# EAGLE design working (EAGLE 5.10)
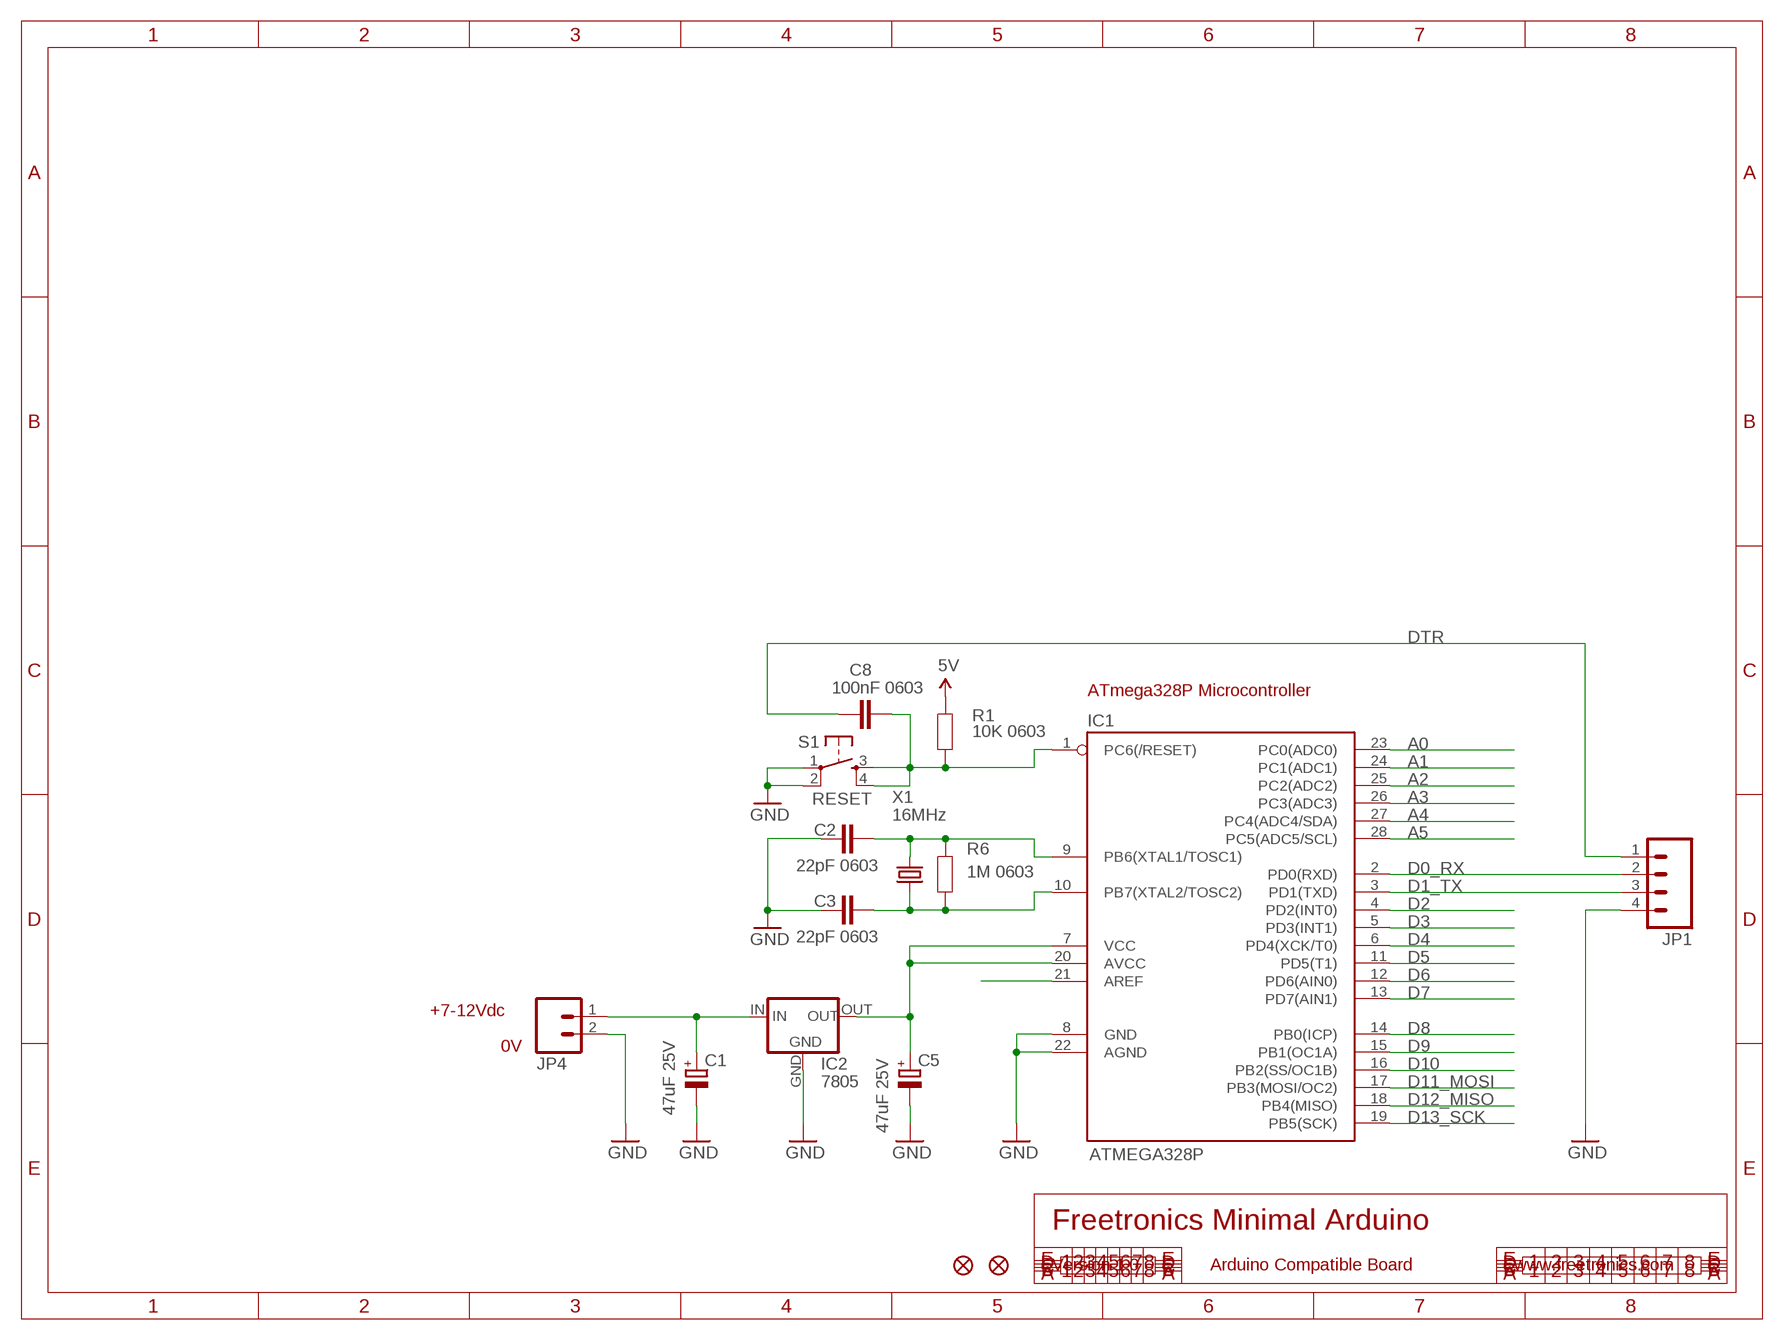
[diagram p0: schematic, sheet 1]

## Parts
C1  47uF 25V  CPOL-EUD  [PANASONIC_D]
C2  22pF 0603  CAP0603  [0603]
C3  22pF 0603  CAP0603  [0603]
C5  47uF 25V  CPOL-EUD  [PANASONIC_D]
C8  100nF 0603  CAP0603  [0603]
IC1  ATMEGA328P  AVR-MEGA8-P  [DIL28-3]
IC2  7805  V_REG_78XXSIDE  [78XXL]
JP1  M04PTH  [1X04]
JP4  M02PTH  [1X02]
R1  10K 0603  RESISTOR0603  [0603]
R6  1M 0603  RESISTOR0603  [0603]
S1  RESET  TAC_SWITCHSMD  [TACTILE_SWITCH_SMD]
U$5  FIDUCIAL1X2.5  [FIDUCIAL-1X2.5]
U$14  FIDUCIAL1X2.5  [FIDUCIAL-1X2.5]
X1  16MHz  CRYSTALHC49UV  [HC49U-V]

## Nets
5V: R1.2
A0: IC1.23(PC0(ADC0))
A1: IC1.24(PC1(ADC1))
A2: IC1.25(PC2(ADC2))
A3: IC1.26(PC3(ADC3))
A4: IC1.27(PC4(ADC4/SDA))
A5: IC1.28(PC5(ADC5/SCL))
AREF: IC1.21(AREF)
D0_RX: IC1.2(PD0(RXD)) JP1.2
D1_TX: IC1.3(PD1(TXD)) JP1.3
D2: IC1.4(PD2(INT0))
D3: IC1.5(PD3(INT1))
D4: IC1.6(PD4(XCK/T0))
D5: IC1.11(PD5(T1))
D6: IC1.12(PD6(AIN0))
D7: IC1.13(PD7(AIN1))
D8: IC1.14(PB0(ICP))
D9: IC1.15(PB1(OC1A))
D10: IC1.16(PB2(SS/OC1B))
D11_MOSI: IC1.17(PB3(MOSI/OC2))
D12_MISO: IC1.18(PB4(MISO))
D13_SCK: IC1.19(PB5(SCK))
DTR: C8.1 JP1.1
GND: C1.- C2.1 C3.1 C5.- IC1.8(GND) IC1.22(AGND) IC2.GND JP1.4 JP4.2 S1.1 S1.2
N$1: C5.+ IC1.7(VCC) IC1.20(AVCC) IC2.OUT
N$5: C2.2 IC1.9(PB6(XTAL1/TOSC1)) R6.2 X1.2
N$7: C3.2 IC1.10(PB7(XTAL2/TOSC2)) R6.1 X1.1
RESET: C8.2 IC1.1(PC6(/RESET)) R1.1 S1.3 S1.4
VIN: C1.+ IC2.IN JP4.1

## Notes on the sheet
- ATmega328P Microcontroller
- +7-12Vdc
- 0V
- Freetronics Minimal Arduino
- Version 1.0 | Arduino Compatible Board | www.freetronics.com

## Library data of the parts
C1 C5 = rcl:CPOL-EU: POLARIZED CAPACITOR, European symbol
C2 C3 C8 = freetronics:CAP: Capacitor Standard 0603 ceramic capacitor, and 0.1" leaded capacitor.
IC1 = freetronics:AVR-MEGA8-P: MICROCONTROLLER 8 Kbytes FLASH 1 kbytes SRAM 512 bytes EEPROM USART 4-channel 10 bit ADC 2-channel 8 bit ADC
IC2 = freetronics-master-v1.1:V_REG_78XX
JP1 = freetronics-master-v1.1:M04: Header 4 Standard 4-pin 0.1" header. Use with straight break away headers (SKU : PRT-00116), right angle break away headers (PRT-00553), swiss pins (PRT-00743), machine pins (PRT-00117), and female headers (PRT-00115). Molex polarized connector foot print use with SKU : PRT-08231 with associated crimp pins and housings.
JP4 = freetronics-master-v1.1:M02: Header 2 Standard 2-pin 0.1" header. Use with straight break away headers (SKU : PRT-00116), right angle break away headers (PRT-00553), swiss pins (PRT-00743), machine pins (PRT-00117), and female headers (PRT-00115). Molex polarized connector foot print use with SKU : PRT-08233 with associated crimp pins and housings.
R1 R6 = freetronics:RESISTOR: Resistor Basic schematic elements and footprints for 0603, 1206, and PTH 1/10th watt (small) resistors.
S1 = freetronics:TAC_SWITCH: Momentary Switch Button commonly used for reset or general input. Spark Fun Electronics SKU : COM-00097
U$5 U$14 = freetronics:FIDUCIAL: Fiducial Alignment Points Various fiducial points for machine vision alignment.
X1 = freetronics-master-v1:CRYSTAL: Crystals Various standard crystals. Proven footprints. Spark Fun Electronics SKU : COM-00534

## Board
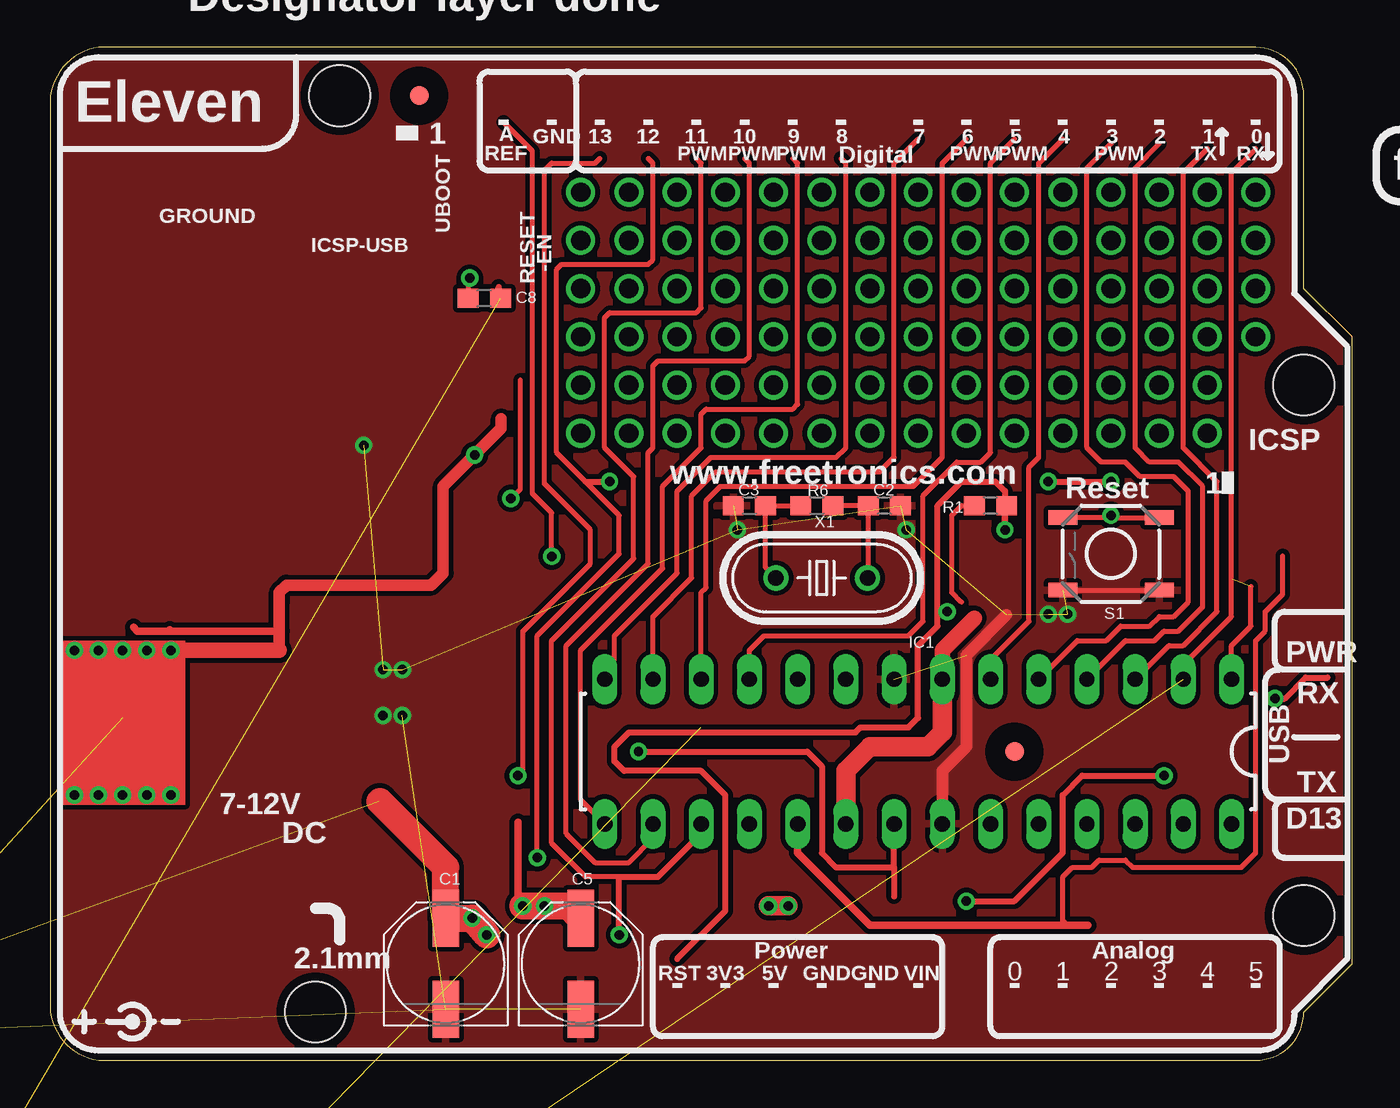
[diagram p1: board, top side]
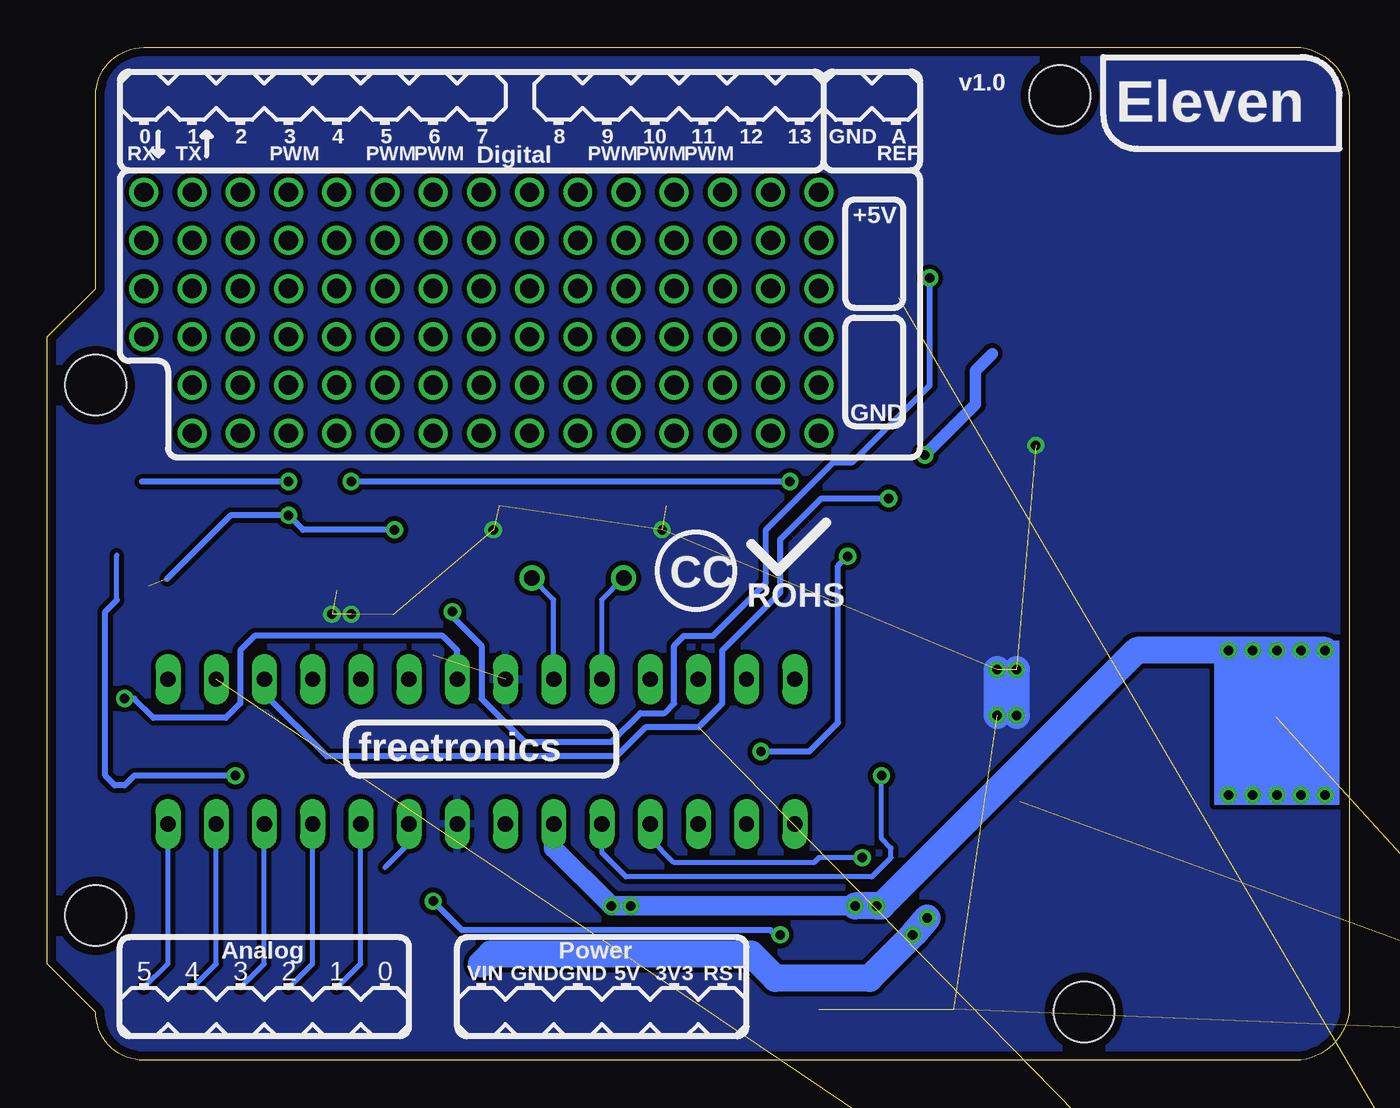
[diagram p2: board, bottom side, seen from below]

Size 68.58 x 53.34 mm. Coordinates in mm from the lower left corner, seen from the top.
Outline: 0,2.54 arc74 2.54,0 63.5,0 arc90 66.04,2.54 68.58,5.08 68.58,38.1 66.04,40.64 66.04,50.8 arc90 63.5,53.34 2.54,53.34 arc74 0,50.8 0,2.54
Copper layers (1*16): Top 0.035mm / dielectric 1.5mm / Bottom 0.035mm
Design rules "default *": minimum track width 10mil, minimum drill 18mil, track to track 10mil, track to pad 10mil, pad to pad 10mil, via to via 10mil, smd to smd 8mil, copper to edge 18mil, drill to drill 8mil, minimum pad ring 10mil, minimum via ring 8mil, stop-mask expansion 4mil, vias tented up to drill 25mil, thermal gap 10mil
Holes 3.2 mm at 66.04,35.56 66.04,7.62 15.24,50.8 13.97,2.54
tRestrict: area 18.4,49.8 to 20.4,51.8; area 49.8,15.2 to 51.8,17.3

### Footprints (pad centres in the part's own frame; a part is rotated, then mirrored left to right if it is on the bottom)
PANASONIC_D = smd 3 x 1.4: + 2.4,0; - -2.4,0
0603 = smd 1.1 x 1: 1 -0.85,0; 2 0.85,0
DIL28-3 = drill 0.813 long: 1 -16.51,-3.81; 2 -13.97,-3.81; 3 -11.43,-3.81; 4 -8.89,-3.81; 5 -6.35,-3.81; 6 -3.81,-3.81; 7 -1.27,-3.81; 8 1.27,-3.81; 9 3.81,-3.81; 10 6.35,-3.81; 11 8.89,-3.81; 12 11.43,-3.81; 13 13.97,-3.81; 14 16.51,-3.81; 15 16.51,3.81; 16 13.97,3.81; 17 11.43,3.81; 18 8.89,3.81; 19 6.35,3.81; 20 3.81,3.81; 21 1.27,3.81; 22 -1.27,3.81; 23 -3.81,3.81; 24 -6.35,3.81; 25 -8.89,3.81; 26 -11.43,3.81; 27 -13.97,3.81; 28 -16.51,3.81
78XXL = drill 1.016 long: GND 0,-3.81; IN -2.54,-3.81; OUT 2.54,-3.81 | hole 3.302: 0,11.176
1X04 = drill 1.016 square: 1 0,0 | drill 1.016 round: 2 2.54,0; 3 5.08,0; 4 7.62,0
1X02 = drill 1.016 round: 1 0,0; 2 2.54,0
TACTILE_SWITCH_SMD = smd 1.524 x 0.762: 1 -2.54,1.905; 2 2.54,1.905; 3 -2.54,-1.905; 4 2.54,-1.905
FIDUCIAL-1X2.5 = smd 1 x 1: 1 0,0
HC49U-V = drill 0.813 round: 1 -2.413,0; 2 2.413,0

### Placement (x,y rotation side)
C1  20.83,5.08 90 top
C2  43.94,29.21 180 top
C3  36.83,29.21 0 top
C5  27.94,5.08 90 top
C8  22.86,40.13 180 top
IC1  45.72,16.26 180 top
IC2  -13.97,5.08 0 top  (outside the outline)
JP1  -17.78,-30.48 0 top  (outside the outline)
JP4  -17.78,-24.13 0 top  (outside the outline)
R1  49.53,29.21 180 top
R6  40.39,29.21 0 top
S1  55.88,26.67 180 top
U$5  19.43,50.8 0 top
U$14  50.8,16.26 0 top
X1  40.64,25.4 0 top

### Tracks (layer width: path | path; a pad name or v marks a point on that pad's centre or on a via)
5V
  Top 0.254: R1.2 48.01,29.21 47.5,28.7 47.5,24.64 48.01,24.13
A0
  Bottom 0.254: 50.8,10.16 49.53,11.43 IC1.23
A1
  Bottom 0.254: 53.34,3.81 52.07,5.08 IC1.24
A2
  Bottom 0.254: 55.88,3.81 54.61,5.08 IC1.25
A3
  Bottom 0.254: 58.42,3.81 57.15,5.08 IC1.26
A4
  Bottom 0.254: 60.96,3.81 59.69,5.08 IC1.27
A5
  Bottom 0.254: 63.5,3.81 62.23,5.08 IC1.28
AREF  (via drill 0.5)
  Top 0.254: 23.88,49.4 25.4,47.88 25.4,29.84 26.42,28.83 v26.42,26.54
  Top 0.305: 44.45,10.16 44.45,8.64 | 44.45,10.16 IC1.21 | 44.45,10.16 41.4,10.16 40.64,10.92 40.64,15.49 39.88,16.26 v30.99,16.26
  Bottom 0.305: v30.99,16.26 28.45,16.26 26.92,17.78 26.92,26.04 v26.42,26.54
D0_RX  (1 unrouted)
  Top 0.254: IC1.2 59.69,20.83 62.23,23.37 62.23,46.74 63.5,48.01
D1_TX  (via drill 0.5)  (1 unrouted)
  Top 0.254: IC1.3 58.93,21.84 59.69,21.84 61.47,23.62 61.47,30.48 59.69,32.26 59.69,46.74 60.96,48.01 | v24.26,29.59 24.77,30.1 24.77,35.81
  Bottom 0.305: v24.26,29.59 27.81,29.59 29.97,27.43 29.97,24.64 33.02,21.59 33.02,18.8 34.29,17.53 37.08,17.53 38.61,16 53.85,16 57.15,19.3 IC1.3
D2
  Top 0.254: IC1.4 56.64,22.1 58.17,22.1 58.67,22.61 59.44,22.61 60.71,23.88 60.71,30.23 59.44,31.5 57.91,31.5 57.15,32.26 57.15,46.99 58.42,48.26
D3
  Top 0.254: IC1.5 54.1,22.1 55.63,22.1 56.39,22.86 57.91,22.86 58.42,23.37 59.18,23.37 59.94,24.13 59.94,29.97 59.18,30.73 57.4,30.73 56.64,31.5 55.37,31.5 54.61,32.26 54.61,46.99 55.88,48.26
D4
  Top 0.254: IC1.6 49.53,21.08 51.56,23.11 51.56,31.24 52.07,31.75 52.07,47.24 53.34,48.51
D5
  Top 0.254: 50.8,48.51 49.53,47.24 49.53,32 49.02,31.5 47.75,31.5 45.97,29.72 45.97,23.11 45.21,22.35 37.59,22.35 36.83,21.59 IC1.11
D6
  Top 0.254: 48.26,48.51 46.99,47.24 46.99,31.75 45.47,30.23 35.31,30.23 34.54,29.46 34.54,24.89 34.29,24.64 IC1.12
D7
  Top 0.254: 45.72,48.51 44.45,47.24 44.45,31.75 43.69,30.99 35.05,30.99 33.78,29.72 33.78,25.4 31.75,23.37 IC1.13
D8
  Top 0.254: 41.66,47.5 41.91,47.24 41.91,32.26 41.4,31.75 34.8,31.75 33.02,29.97 33.02,25.65 29.72,22.35 29.72,21.08 29.21,20.57 IC1.14
D9
  Top 0.254: 39.12,47.5 39.37,47.24 39.37,34.54 39.12,34.29 34.54,34.29 34.29,34.04 34.29,32.26 32.26,30.23 32.26,25.91 27.94,21.59 27.94,13.72 IC1.15
D10
  Top 0.254: 36.58,47.5 36.83,47.24 36.83,37.08 36.58,36.83 32,36.83 31.75,36.58 31.75,32.26 31.5,32 31.5,26.16 27.18,21.84 27.18,11.94 28.7,10.41 30.48,10.41 31.75,11.68 IC1.16
D11_MOSI  (via drill 0.5)
  Top 0.254: 34.04,47.5 34.29,47.24 34.29,39.62 34.04,39.37 29.46,39.37 29.21,39.12 29.21,32.26 30.73,30.73 30.73,26.42 26.42,22.1 26.42,11.43 28.19,9.65 30.23,9.65
  Top 0.305: IC1.17 34.29,11.94 32,9.65 30.23,9.65 29.97,9.65 v29.97,6.6 | v58.67,14.99 54.36,14.99 53.34,13.97 53.34,10.92 50.8,8.38 v48.26,8.38
  Bottom 0.254: 64.92,24.23 64.92,26.61
  Bottom 0.305: 64.92,24.23 65.53,23.62 65.53,14.99 65.02,14.48 64.52,14.48 64.01,14.99 v58.67,14.99 | v48.26,8.38 46.74,6.86 30.48,6.86 30.23,6.6 v29.97,6.6
D12_MISO  (via drill 0.5)
  Top 0.254: 31.5,47.5 31.75,47.24 31.75,42.16 31.5,41.91 26.92,41.91 26.67,41.66 26.67,32 28.19,30.48 29.97,28.7 29.97,26.67 25.65,22.35 v25.65,10.67
  Top 0.305: v52.58,30.48 v55.88,30.48 | 28.19,30.48 v29.46,30.48
  Bottom 0.254: v25.65,10.67 27.94,10.67 28.19,10.41 35.56,10.41 36.83,11.68 IC1.18
  Bottom 0.305: v55.88,30.48 63.59,30.48 | v29.46,30.48 v52.58,30.48
D13_SCK  (via drill 0.5)
  Top 0.254: 28.96,47.5 28.7,47.24 26.42,47.24 26.04,46.86 26.04,30.35 28.45,27.94 28.45,26.16 24.89,22.61 24.89,15.24 v24.64,14.99 | 64.92,26.57 64.92,24.54 64.01,23.62 64.01,22.61 63.5,22.1 63.5,10.92 62.74,10.16 57.02,10.16 56.64,10.54 55.24,10.54 54.86,10.16 53.85,10.16 53.34,9.65 53.34,7.37 53.59,7.11
  Top 0.406: IC1.19 39.37,10.92 43.18,7.11 53.59,7.11 54.66,7.11
  Bottom 0.254: v24.64,14.99 24.64,11.68 24.13,11.18 24.13,10.67 25.15,9.65 38.1,9.65 39.37,10.92 IC1.19
DTR  (1 unrouted)
  Top 0.305: C8.1 23.62,40.73
GND  (via drill 0.5)  (16 unrouted)
  Top 0.254: S1.2 S1.1
  Top 0.61: 50.38,23.46 48.26,21.34 48.26,16.51 46.99,15.24 IC1.22
  Bottom 1.422: v18.54,18.16 v18.54,20.57 | v17.53,18.16 v17.53,20.57
  other vias: 36.2,27.94 16.51,32.38 52.58,23.5 53.59,23.5 45.09,27.94
  pour Bottom: 0,50.8 arc-74 2.54,53.34 63.5,53.34 arc-74 66.04,50.8 66.04,40.64 68.58,38.1 68.58,5.08 66.04,2.54 arc-74 63.5,0 2.54,0 arc-74 0,2.54
  pour Top: 0,50.8 arc-74 2.54,53.34 63.5,53.34 arc-74 66.04,50.8 66.04,40.64 68.58,38.1 68.58,5.08 66.04,2.54 arc-74 63.5,0 2.54,0 arc-74 0,2.54
N$1  (via drill 0.5)  (1 unrouted)
  Top 0.254: 12.06,24.13 11.98,24.05
  Top 0.305: 67.3,20.15 66.12,20.15 65.02,19.05 v64.52,19.05
  Top 0.406: v24.89,8.13 24.64,8.38 24.64,12.53 | 4.38,22.79 4.57,22.61 6.22,22.61 | 12.06,22.61 6.22,22.61 | 6.22,22.61 6.28,22.67
  Top 0.61: 23.75,33.78 23.75,33.27 v22.35,31.88 20.7,30.23 20.7,25.65 20.07,25.02 12.45,25.02 12.06,24.64 12.06,24.13 12.06,22.61 12.06,21.59
  Top 0.813: v5.08,21.59 v6.35,21.59 12.06,21.59 | IC1.7 46.99,21.59 48.68,23.28
  Top 1.016: 3.85,18.07 5.08,19.3 v5.08,21.59 | v37.85,8.13 38.1,8.13 v38.86,8.13 | IC1.20 41.91,15.24 43.18,16.51 46.23,16.51 46.99,17.27 IC1.7
  Top 1.422: C5.+ 27.29,8.13 v24.89,8.13
  Bottom 0.305: v64.52,19.05 64.01,19.05 62.99,18.03 59.18,18.03 58.42,18.8 58.42,21.59 57.66,22.35 47.75,22.35 46.99,21.59 IC1.7
  Bottom 0.61: 18.8,37.21 19.68,36.32 19.68,34.54 v22.35,31.88
  Bottom 1.016: IC1.20 41.91,11.18 v38.86,8.13 v37.85,8.13 v26.04,8.13
  Bottom 1.422: v26.04,8.13 v24.89,8.13 24.64,8.13 11.18,21.59 v6.35,21.59 1.27,21.59
N$5
  Top 0.254: R6.2 C2.2 43.09,25.44 X1.2
  Bottom 0.254: X1.2 41.91,24.26 IC1.9
N$7
  Top 0.254: X1.1 37.68,25.95 C3.2 R6.1
  Bottom 0.254: X1.1 39.37,24.26 IC1.10
N$15  (via drill 1.02)
  other vias: 33.02,40.64
N$18  (via drill 1.02)
  other vias: 33.02,43.18
N$19  (via drill 1.02)
  other vias: 33.02,45.72
N$20  (via drill 1.02)
  other vias: 30.48,40.64
N$21  (via drill 1.02)
  other vias: 30.48,43.18
N$22  (via drill 1.02)
  other vias: 30.48,45.72
N$23  (via drill 1.02)
  other vias: 27.94,40.64
N$24  (via drill 1.02)
  other vias: 27.94,43.18
N$25  (via drill 1.02)
  other vias: 27.94,45.72
N$26  (via drill 1.02)
  other vias: 40.64,40.64
N$27  (via drill 1.02)
  other vias: 40.64,43.18
N$28  (via drill 1.02)
  other vias: 40.64,45.72
N$29  (via drill 1.02)
  other vias: 38.1,40.64
N$30  (via drill 1.02)
  other vias: 38.1,43.18
N$31  (via drill 1.02)
  other vias: 38.1,45.72
N$32  (via drill 1.02)
  other vias: 35.56,40.64
N$33  (via drill 1.02)
  other vias: 35.56,43.18
N$34  (via drill 1.02)
  other vias: 35.56,45.72
N$35  (via drill 1.02)
  other vias: 48.26,40.64
N$36  (via drill 1.02)
  other vias: 48.26,43.18
N$37  (via drill 1.02)
  other vias: 48.26,45.72
N$38  (via drill 1.02)
  other vias: 45.72,40.64
N$39  (via drill 1.02)
  other vias: 45.72,43.18
N$40  (via drill 1.02)
  other vias: 45.72,45.72
N$41  (via drill 1.02)
  other vias: 43.18,40.64
N$42  (via drill 1.02)
  other vias: 43.18,43.18
N$43  (via drill 1.02)
  other vias: 43.18,45.72
N$44  (via drill 1.02)
  other vias: 55.88,40.64
N$45  (via drill 1.02)
  other vias: 55.88,43.18
N$46  (via drill 1.02)
  other vias: 55.88,45.72
N$47  (via drill 1.02)
  other vias: 53.34,40.64
N$48  (via drill 1.02)
  other vias: 53.34,43.18
N$49  (via drill 1.02)
  other vias: 53.34,45.72
N$50  (via drill 1.02)
  other vias: 50.8,40.64
N$51  (via drill 1.02)
  other vias: 50.8,43.18
N$52  (via drill 1.02)
  other vias: 50.8,45.72
N$53  (via drill 1.02)
  other vias: 63.5,40.64
N$54  (via drill 1.02)
  other vias: 63.5,43.18
N$55  (via drill 1.02)
  other vias: 63.5,45.72
N$56  (via drill 1.02)
  other vias: 60.96,40.64
N$57  (via drill 1.02)
  other vias: 60.96,43.18
N$58  (via drill 1.02)
  other vias: 60.96,45.72
N$59  (via drill 1.02)
  other vias: 58.42,40.64
N$60  (via drill 1.02)
  other vias: 58.42,43.18
N$61  (via drill 1.02)
  other vias: 58.42,45.72
N$62  (via drill 1.02)
  other vias: 33.02,33.02
N$63  (via drill 1.02)
  other vias: 33.02,35.56
N$64  (via drill 1.02)
  other vias: 33.02,38.1
N$65  (via drill 1.02)
  other vias: 30.48,33.02
N$66  (via drill 1.02)
  other vias: 30.48,35.56
N$67  (via drill 1.02)
  other vias: 30.48,38.1
N$68  (via drill 1.02)
  other vias: 27.94,33.02
N$69  (via drill 1.02)
  other vias: 27.94,35.56
N$70  (via drill 1.02)
  other vias: 27.94,38.1
N$71  (via drill 1.02)
  other vias: 40.64,33.02
N$72  (via drill 1.02)
  other vias: 40.64,35.56
N$73  (via drill 1.02)
  other vias: 40.64,38.1
N$74  (via drill 1.02)
  other vias: 38.1,33.02
N$75  (via drill 1.02)
  other vias: 38.1,35.56
N$76  (via drill 1.02)
  other vias: 38.1,38.1
N$77  (via drill 1.02)
  other vias: 35.56,33.02
N$78  (via drill 1.02)
  other vias: 35.56,35.56
N$79  (via drill 1.02)
  other vias: 35.56,38.1
N$80  (via drill 1.02)
  other vias: 48.26,33.02
N$81  (via drill 1.02)
  other vias: 48.26,35.56
N$82  (via drill 1.02)
  other vias: 48.26,38.1
N$83  (via drill 1.02)
  other vias: 45.72,33.02
N$84  (via drill 1.02)
  other vias: 45.72,35.56
N$85  (via drill 1.02)
  other vias: 45.72,38.1
N$86  (via drill 1.02)
  other vias: 43.18,33.02
N$87  (via drill 1.02)
  other vias: 43.18,35.56
N$88  (via drill 1.02)
  other vias: 43.18,38.1
N$89  (via drill 1.02)
  other vias: 55.88,33.02
N$90  (via drill 1.02)
  other vias: 55.88,35.56
N$91  (via drill 1.02)
  other vias: 55.88,38.1
N$92  (via drill 1.02)
  other vias: 53.34,33.02
N$93  (via drill 1.02)
  other vias: 53.34,35.56
N$94  (via drill 1.02)
  other vias: 53.34,38.1
N$95  (via drill 1.02)
  other vias: 50.8,33.02
N$96  (via drill 1.02)
  other vias: 50.8,35.56
N$97  (via drill 1.02)
  other vias: 50.8,38.1
N$98  (via drill 0.5)
  other vias: 6.35,13.97
N$99  (via drill 0.5)
  other vias: 5.08,13.97
N$100  (via drill 1.02)
  other vias: 63.5,38.1
N$101  (via drill 1.02)
  other vias: 60.96,33.02
N$102  (via drill 1.02)
  other vias: 60.96,35.56
N$103  (via drill 1.02)
  other vias: 60.96,38.1
N$104  (via drill 1.02)
  other vias: 58.42,33.02
N$105  (via drill 1.02)
  other vias: 58.42,35.56
N$106  (via drill 1.02)
  other vias: 58.42,38.1
N$107  (via drill 0.5)
  other vias: 3.81,13.97
N$108  (via drill 0.5)
  other vias: 2.54,13.97
N$109  (via drill 0.5)
  other vias: 3.81,21.59
N$110  (via drill 0.5)
  other vias: 2.54,21.59
N$111  (via drill 0.5)
  other vias: 1.27,21.59
N$112  (via drill 0.5)
  other vias: 1.27,13.97
RESET  (via drill 0.5)  (1 unrouted)
  Top 0.254: IC1.1 62.23,21.84 63.25,22.86 63.25,24.96 | 55.88,28.57 S1.4 | 55.88,28.57 S1.3 | v55.88,28.7 55.88,28.57 | 50.29,29.3 R1.1 | C8.2 22.01,41.12 v22.1,41.2
  Top 0.305: 50.29,29.3 v50.29,27.94 50.29,29.97 49.78,30.48 48.01,30.48 46.74,29.21 46.74,23.62 | 46.74,23.62 46.74,22.86 45.72,21.84 45.72,18.03 45.21,17.53 42.67,17.53 42.42,17.27 30.48,17.27 29.72,16.51 29.72,15.75 30.23,15.24 34.29,15.24 35.56,13.97 35.56,7.87 33.02,5.33 | 46.74,23.62 v47.24,23.62
  Bottom 0.305: v50.29,27.94 55.12,27.94 v55.88,28.7 58.93,28.7 62.28,25.35 | v47.24,23.62 47.24,23.37 45.72,21.84 45.72,19.05 43.43,16.76 38.86,16.76 37.34,18.29 36.07,18.29 35.56,18.8 35.56,21.84 35.05,22.35 33.53,22.35 30.73,25.15 30.73,27.94 27.18,31.5 26.16,31.5 22.1,35.56 v22.1,41.2
VIN  (via drill 0.5)  (2 unrouted)
  Top 1.422: 17.36,13.63 20.83,10.16 C1.+ v22.24,7.48 v22.23,7.49 v22.99,6.6
  Bottom 1.422: 45.72,5.08 45.21,5.59 31.5,5.59 30.23,4.32 25.27,4.32 v22.99,6.6 v22.23,7.49
(copper drawn outside any net)
  shapes: Bottom area x1, Top area x1

### Text on the board
tPlace: Ground split planes and section connections | Possible SMT HC49S change | Connect 2 SJ jumpers across after everything 100% | Markings and labels | SKU and all other friendly markings | Designator layer done | Eleven | 1 | A | GND | 13 | 12 | 11 | 10 | 9 | 8 | 7 | 6 | 5 | 4 | 3 | 2 | 1 | 0 | REF | PWM | PWM | PWM | Digital | PWM | PWM | PWM | TX | RX | freetronics | GROUND | UBOOT | ICSP-USB | -EN | RESET | ICSP | www.freetronics.com | Reset | 1 | PWR | RX | USB | TX | 7-12V | D13 | DC | 2.1mm | Power | Analog | RST | 3V3 | 5V | GND | GND | VIN | 0 | 1 | 2 | 3 | 4 | 5
bPlace: v1.0 | Eleven | A | GND | 13 | 12 | 11 | 10 | 9 | 8 | 7 | 6 | 5 | 4 | 3 | 2 | 1 | 0 | REF | PWM | PWM | PWM | Digital | PWM | PWM | PWM | TX | RX | +5V | GND | CC | ROHS | freetronics | Power | Analog | RST | 3V3 | 5V | GND | GND | VIN | 0 | 1 | 2 | 3 | 4 | 5